# Altium schematic sheet MCU_CLOCK_AND_USER_INTERFACE.SchDoc: MCU_CLOCK_AND_USER_INTERFACE
size A4; Date: Not used; ApprovedBy: Not used; CheckedBy: Not used; Author: Not used; CompanyName: STMicroelectronics; DrawnBy: Not used; Engineer: Not used; Organization: Not used; Address1: Not used; Address2: Not used; Address3: Not used; Address4: Not used; DocumentNumber: Not used; Revision: Not used; SheetNumber: 4; SheetTotal: 16; CurrentTime: Not used; CurrentDate: Not used; Time: Not used; DocumentFullPathAndName: Not used; DocumentName: Not used; ModifiedDate: Not used; ImagePath: Not used; ProjectName: Not used; Application_BuildNumber: Not used
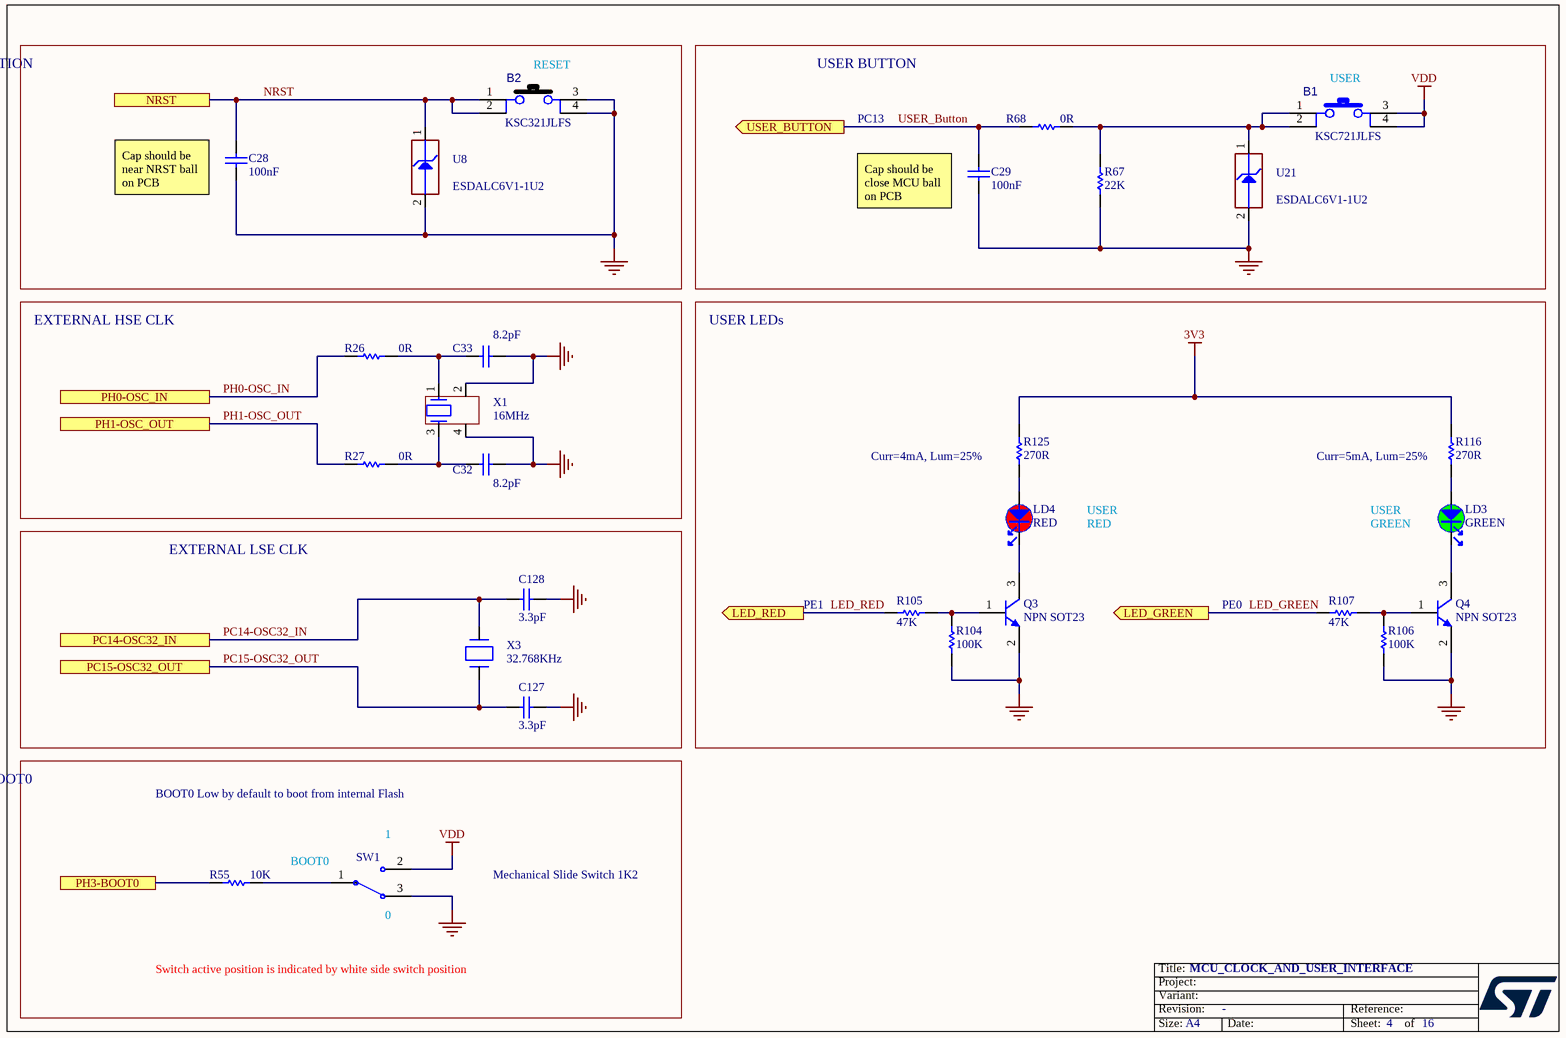
[diagram p0: MCU_CLOCK_AND_USER_INTERFACE.SchDoc]

## Parts
B1  value KSC721JLFS  [SWI_C&K_KSC721JLFS_BLUE]  (hidden comment: SW_BLUE_KSC721JLFS)
B2  value KSC321JLFS  [SWI_C&K_KSC321JLFS_BLACK]  (hidden comment: SW_BLACK_KSC321JLFS)
C28  value 100nF  [C0402]  (hidden comment: Capacitor)
C29  value 100nF  [C0402]  (hidden comment: Capacitor)
C32  value 8.2pF  [C0402]  (hidden comment: Capacitor)
C33  value 8.2pF  [C0402]  (hidden comment: Capacitor)
C127  value 3.3pF  [C0402]  (hidden comment: Capacitor)
C128  value 3.3pF  [C0402]  (hidden comment: Capacitor)
LD3  value GREEN  [LED_0603_OSRAM_LG-Q396-PS-35_GREEN_1A2K_H0P4]  (hidden comment: LED_green)
LD4  value RED  [LED_0603_OSRAM_LS-Q976-NR-1_RED_1A2K_H0P8]  (hidden comment: LED_red)
Q3  value NPN SOT23  [NPN_SOT23]  (hidden comment: 9013-SOT23)
Q4  value NPN SOT23  [NPN_SOT23]  (hidden comment: 9013-SOT23)
R26  value 0R  [R0402]  (hidden comment: Resistor)
R27  value 0R  [R0402]  (hidden comment: Resistor)
R55  value 10K  [R0603]  (hidden comment: Resistor)
R67  value 22K  [R0603]  (hidden comment: Resistor)
R68  value 0R  [R0603]  (hidden comment: Resistor)
R104  value 100K  [R0603]  (hidden comment: Resistor)
R105  value 47K  [R0603]  (hidden comment: Resistor)
R106  value 100K  [R0603]  (hidden comment: Resistor)
R107  value 47K  [R0603]  (hidden comment: Resistor)
R116  value 270R  [R0402]  (hidden comment: Resistor)
R125  value 270R  [R0402]  (hidden comment: Resistor)
SW1  value Mechanical Slide Switch 1K2  [SWI_EAO_09-03290-01_EXTENDED_STRAIGHT_BLACK]  (hidden comment: SW_MECA_1K2)
U8  value ESDALC6V1-1U2  [ESD_ST0201]  (hidden comment: ESD-TRANSIL)
U21  value ESDALC6V1-1U2  [ESD_ST0201]  (hidden comment: ESD-TRANSIL)
X1  value 16MHz  [CRY_NX2016SA_4P]  (hidden comment: XTAL_4_PINS)
X3  value 32.768KHz  [CRY_NX2012SA_2P]  (hidden comment: XTAL_2_PINS)

## Blocks framed on the sheet
RESET FUNCTION: B2 C28 U8
USER BUTTON: B1 C29 R67 R68 U21
EXTERNAL HSE CLK: C32 C33 R26 R27 X1
USER LEDs: LD3 LD4 Q3 Q4 R104-R107 R116 R125
EXTERNAL LSE CLK: C127 C128 X3
PH3_BOOT0: R55 SW1

## Ports
LED_GREEN (out), LED_RED (out), NRST, PC14-OSC32_IN, PC15-OSC32_OUT, PH0-OSC_IN, PH1-OSC_OUT, PH3-BOOT0, USER_BUTTON (out)

## Nets
3V3: R116.2 R125.2
GND: B2.3 B2.4 C28.1 C29.1 C32.2 C33.2 C127.2 C128.2 Q3.2(E) Q4.2(E) R67.1 R104.1 R106.1 SW1.3 U8.2(GND) U21.2(GND) X1.2 X1.4
VDD: B1.3 B1.4 SW1.2
LED_GREEN: R107.1 ; port LED_GREEN
LED_RED: R105.1 ; port LED_RED
NRST: B2.1 B2.2 C28.2 U8.1(IO1) ; port NRST
PC14-OSC32_IN: C128.1 X3.2(X2) ; port PC14-OSC32_IN
PC15-OSC32_OUT: C127.1 X3.1(X1) ; port PC15-OSC32_OUT
PH0-OSC_IN: R26.1 ; port PH0-OSC_IN
PH1-OSC_OUT: R27.1 ; port PH1-OSC_OUT
PH3-BOOT0: R55.1 ; port PH3-BOOT0
USER_Button: C29.2 R68.1 ; port USER_BUTTON
NetB1_1: B1.1 B1.2 R67.2 R68.2 U21.1(IO1)
NetC32_1: C32.1 R27.2 X1.3
NetC33_1: C33.1 R26.2 X1.1
NetLD3_1: LD3.1 R116.1
NetLD3_2: LD3.2 Q4.3(C)
NetLD4_1: LD4.1 R125.1
NetLD4_2: LD4.2 Q3.3(C)
NetQ3_1: Q3.1(B) R104.2 R105.2
NetQ4_1: Q4.1(B) R106.2 R107.2
NetR55_2: R55.2 SW1.1

## Notes on the sheet
- (near B2) RESET
- (near B1) USER
- PC13
- (near C28) Cap should be near NRST ball on PCB
- (near C29) Cap should be close MCU ball on PCB
- Curr=4mA, Lum=25%
- USER
- Curr=5mA, Lum=25%
- RED
- GREEN
- PE1
- PE0
- BOOT0 Low by default to boot from internal Flash
- (near SW1) 1
- BOOT0
- (near SW1) 0
- Switch active position is indicated by white side switch position
- Title:
- Project:
- Size:
- Revision:
- Variant:
- A4
- -
- Date:
- Reference:
- Sheet:
- of

## Library data of the parts
B1 = MCD-01800: Switch HW BLUE High4.3mm 2.25 Newtons, BEND type; Part_Type: Misc; Manufacturer: C&K; Part_Preference: Recommended; Component_Country_Of_Origin: France; Internal_Part_Number: MCD-01800; Status: Released; Manufacturer_Part_Number: KSC721JLFS; ComponentLink1URL: http://tunmcdsvn.tun.st.com/Component_Datasheet_Library/Trunk/Misc/C&K_tactile_switch_KSC_series
B2 = MCD-01799: Switch HW BLACK High3.5mm 2Newtons, BEND type; Part_Type: Misc; Manufacturer: C&K; Part_Preference: Recommended; Component_Country_Of_Origin: France; Internal_Part_Number: MCD-01799; Status: Released; Manufacturer_Part_Number: KSC321JLFS; ComponentLink1URL: http://tunmcdsvn.tun.st.com/Component_Datasheet_Library/Trunk/Misc/C&K_tactile_switch_KSC_series
C28 C29 = MCD-00006: Capacitor, MLCC, 100nF, 16V, X7R, +/-10%, 0402, T=0.5mm; Manufacturer_Part_Number: CC0402KRX7R7BB104; Manufacturer: YAGEO; Part_Preference: Recommended; Order_Code_RS: 616-9701; Component_Country_Of_Origin: China; Internal_Part_Number: MCD-00006; Status: Released; Part_Type: Capacitor; Package: 0402; ComponentLink1URL: http://tunmcdsvn.tun.st.com/Component_Documentation_Library/Trunk/Capacitor/YAGEO_X7R_Series; Order_Code_Digikey: 311-1338-1-ND; Order_Code_Farnell: 9402047
C32 C33 = MCD-01932: Capacitor, MLCC, 8.2pF, 50V, NPO, +/-0.25pF, 0402, T=0.5mm; Part_Preference: Recommended; Manufacturer: YAGEO; Manufacturer_Part_Number: CC0402CRNPO9BN8R2; Component_Country_Of_Origin: China; Internal_Part_Number: MCD-01932; Status: Released; Part_Type: Capacitor; Package: 0402; ComponentLink1URL: http://tunmcdsvn.tun.st.com/Component_Documentation_Library/Trunk/Capacitor/YAGEO_NP0_Series; Order_Code_Digikey: 311-1635-1-ND; Order_Code_Farnell: N/A; Order_Code_RS: N/A
C127 C128 = MCD-01775: Capacitor, MLCC, 3.3pF, 50V, NPO, +/-0.1pF, 0402, T=0.5mm; Part_Preference: Recommended; Manufacturer: YAGEO; Manufacturer_Part_Number: CC0402BRNPO9BN3R3; Component_Country_Of_Origin: China; Internal_Part_Number: MCD-01775; Status: Released; Part_Type: Capacitor; Package: 0402; ComponentLink1URL: http://tunmcdsvn.tun.st.com/Component_Documentation_Library/Trunk/Capacitor/YAGEO_NP0_Series; Order_Code_Digikey: 311-1621-1-ND; Order_Code_Farnell: N/A; Order_Code_RS: N/A
LD3 = MCD-00588: LED Green, 0603 SMD, Forward Voltage Typ=2V, Max=2.5V; Part_Type: Display; Manufacturer_Part_Number: LG Q396-PS-35; Manufacturer: OSRAM OPTO SEMICONDUCTORS; Part_Preference: Recommended; Alternate_Internal_Part_Number: MCD-02400; Component_Country_Of_Origin: Unknown; ShowFields: YES; ID: 3155; Internal_Part_Number: MCD-00588; Status: Released; Package: LED 0603; ComponentLink1URL: http://tunmcdsvn.tun.st.com/Component_Datasheet_Library/Trunk/Display/OSRAM_LED_GREEN_LG Q396-PS-35; Order_Code_Digikey: LG Q396-PS-35-ND
LD4 = MCD-00586: LED Red, 0603 SMD, Forward Voltage Typ=2V, Max=2.5V; Manufacturer_Part_Number: LS Q976-NR-1; Manufacturer: OSRAM OPTO SEMICONDUCTORS; Part_Type: Display; Part_Preference: Recommended; Component_Country_Of_Origin: Unknown; ShowFields: YES; ID: 3158; Internal_Part_Number: MCD-00586; Status: Released; ComponentLink1URL: http://tunmcdsvn.tun.st.com/Component_Datasheet_Library/Trunk/Display/OSRAM_LED_RED_LS Q976-NR-1; Package: LED 0603; Order_Code_Digikey: 475-2512-1-ND
Q3 Q4 = MCD-00073: NPN Bipolar Transistor; Part_Type: IC; Manufacturer_Part_Number: BSR14; Manufacturer: ON SEMICONDUCTOR; Part_Preference: Recommended; Component_Country_Of_Origin: Unknown; Revision: *; Internal_Part_Number: MCD-00073; Status: Released; ComponentLink1URL: http://tunmcdsvn.tun.st.com/Component_Datasheet_Library/Trunk/IC/NXP_Transistor_BSR14; Package: SOT23
R26 R27 = MCD-00052: Resistor, 0R, 0402, +/-5%, 1/16W; Manufacturer_Part_Number: RC0402JR-070RL; Manufacturer: YAGEO; Part_Preference: Recommended; Order_Code_RS: 618-5804; Component_Country_Of_Origin: China; Internal_Part_Number: MCD-00052; Status: Released; Part_Type: Resistor; Package: 0402; ComponentLink1URL: http://tunmcdsvn.tun.st.com/Component_Documentation_Library/Trunk/Resistor/YAGEO_RC_L_Series; Order_Code_Digikey: 311-0.0JRCT-ND; Order_Code_Farnell: 9232516RL
R55 = MCD-00220: Resistor, 10K, 0603, +/-1%, 1/10W; Manufacturer_Part_Number: RC0603FR-0710KL; Manufacturer: YAGEO; Part_Preference: Recommended; Component_Country_Of_Origin: China; Internal_Part_Number: MCD-00220; Status: Released; Part_Type: Resistor; Package: 0603; ComponentLink1URL: http://tunmcdsvn.tun.st.com/Component_Documentation_Library/Trunk/Resistor/YAGEO_RC_L_Series; Order_Code_Digikey: 311-10.0KHRCT-ND; Order_Code_Farnell: 9238603; Order_Code_RS: N/A
R67 = MCD-00430: Resistor, 22K, 0603, +/-1%, 1/10W; Manufacturer_Part_Number: RC0603FR-0722KL; Manufacturer: YAGEO; Part_Preference: Recommended; Component_Country_Of_Origin: China; ShowFields: YES; ID: 2847; Internal_Part_Number: MCD-00430; Status: Released; Part_Type: Resistor; Package: 0603; ComponentLink1URL: http://tunmcdsvn.tun.st.com/Component_Documentation_Library/Trunk/Resistor/YAGEO_RC_L_Series; Order_Code_Digikey: 311-22.0KHRCT-ND; Order_Code_Farnell: 9238646; Order_Code_RS: N/A
R68 = MCD-00056: Resistor, 0R, 0603, +/-5%, 1/10W; Manufacturer_Part_Number: RC0603JR-070RL; Manufacturer: YAGEO; Part_Preference: Recommended; Component_Country_Of_Origin: China; ShowFields: YES; ID: 2536; Internal_Part_Number: MCD-00056; Status: Released; Part_Type: Resistor; Package: 0603; ComponentLink1URL: http://tunmcdsvn.tun.st.com/Component_Documentation_Library/Trunk/Resistor/YAGEO_RC_L_Series; Order_Code_Digikey: 311-0.0GRCT-ND; Order_Code_Farnell: 9233130RL; Order_Code_RS: N/A
R104 R106 = MCD-00223: Resistor, 100K, 0603, +/- 1%, 1/10W; Manufacturer_Part_Number: RC0603FR-07100KL; Manufacturer: YAGEO; Part_Preference: Recommended; Component_Country_Of_Origin: China; Internal_Part_Number: MCD-00223; Status: Released; Part_Type: Resistor; Package: 0603; ComponentLink1URL: http://tunmcdsvn.tun.st.com/Component_Documentation_Library/Trunk/Resistor/YAGEO_RC_L_Series; Order_Code_Digikey: 311-100KHRTR-ND; Order_Code_Farnell: 2421851; Order_Code_RS: N/A
R105 R107 = MCD-00222: Resistor, 47K, 0603, 1%, 1/10W; Manufacturer_Part_Number: RC0603FR-0747KL; Manufacturer: YAGEO; Part_Preference: Recommended; Component_Country_Of_Origin: China; Internal_Part_Number: MCD-00222; Status: Released; Part_Type: Resistor; Package: 0603; ComponentLink1URL: http://tunmcdsvn.tun.st.com/Component_Documentation_Library/Trunk/Resistor/YAGEO_RC_L_Series; Order_Code_Digikey: 311-47.0KHRCT-ND; Order_Code_Farnell: 9238689; Order_Code_RS: N/A
R116 = MCD-00441: Resistor, 270R, 0402, +/-1%, 1/16W; Manufacturer: YAGEO; Manufacturer_Part_Number: RC0402FR-07270RL; Part_Preference: Recommended; Component_Country_Of_Origin: China; ShowFields: YES; ID: 2838; Internal_Part_Number: MCD-00441; Status: Released; Part_Type: Resistor; Package: 0402; ComponentLink1URL: http://tunmcdsvn.tun.st.com/Component_Documentation_Library/Trunk/Resistor/YAGEO_RC_L_Series; Order_Code_Digikey: 311-270LRCT-ND; Order_Code_Farnell: 9239162; Order_Code_RS: N/A
R125 = MCD-00441: Resistor, 270R, 0402, +/-1%, 1/16W; Manufacturer_Part_Number: RC0402FR-07270RL; Manufacturer: YAGEO; Part_Preference: Recommended; Component_Country_Of_Origin: China; ShowFields: YES; ID: 2838; Internal_Part_Number: MCD-00441; Status: Released; Part_Type: Resistor; Package: 0402; ComponentLink1URL: http://tunmcdsvn.tun.st.com/Component_Documentation_Library/Trunk/Resistor/YAGEO_RC_L_Series; Order_Code_Digikey: 311-270LRCT-ND; Order_Code_Farnell: 9239162; Order_Code_RS: N/A
SW1 = MCD-00566: Mechanical Slide Switches 1K2 BLK ACT GOLD STRT MNT; Part_Preference: Recommended; Part_Type: Misc; Manufacturer: EAO; Manufacturer_Part_Number: 09.03290.01; Component_Country_Of_Origin: Switzerland; Internal_Part_Number: MCD-00566; Status: Released; ComponentLink1URL: http://tunmcdsvn.tun.st.com/Component_Datasheet_Library/Trunk/Misc/EAO_SWITCH_09.03290.01
U8 U21 = MCD-00170: ESD protection 6V1; Part_Type: Diode; Manufacturer: STMICROELECTRONICS; BMS_Part_Number: 9151132; Part_Preference: Recommended; Manufacturer_HQ_COO: EU; Component_Country_Of_Origin: China; Internal_Part_Number: MCD-00170; Status: Released; Manufacturer_Part_Number: ESDALC6V1-1U2; ComponentLink1URL: http://tunmcdsvn.tun.st.com/Component_Datasheet_Library/Trunk/Diodes/STM_ESD_ESDALC6V1-1U2
X1 = MCD-01476: Crystal, 16 MHz, 8pF, +/-20ppm, 200R, 2x1.6mm; Part_Type: Crystal_Osc; Manufacturer_Part_Number: NX2016SA-16MHZ-EXS00A-CS07826; Manufacturer: NDK; BMS_Part_Number: 9157046; Part_Preference: Recommended; Component_Country_Of_Origin: Unknown; Internal_Part_Number: MCD-01476; Status: Released; Package: 2x1.6mm; ComponentLink1URL: http://tunmcdsvn.tun.st.com/Component_Documentation_Library/Trunk/Crytal_Oscillator/NDK_NX2016SA_Series; Order_Code_Digikey: 644-1360; Order_Code_Farnell: N/A; Order_Code_RS: N/A
X3 = MCD-01479: Crystal, 32.768kHz, 6pF, +/-20ppm, 80K, 2.05x1.2mm; Part_Type: Crystal_Osc; Manufacturer_Part_Number: NX2012SA-32.768KHZ-EXS00A-MU00527; Manufacturer: NDK; BMS_Part_Number: 9157049; Part_Preference: Recommended; Component_Country_Of_Origin: Unknown; Internal_Part_Number: MCD-01479; Status: Released; Package: 2.05x1.2mm; ComponentLink1URL: http://tunmcdsvn.tun.st.com/Component_Documentation_Library/Trunk/Crytal_Oscillator/NDK_NX2012SA_Series; Order_Code_Digikey: 644-1352; Order_Code_Farnell: N/A; Order_Code_RS: N/A